# Altium schematic sheet WatchDog.SchDoc
size A; SheetNumber: 17; SheetTotal: 18
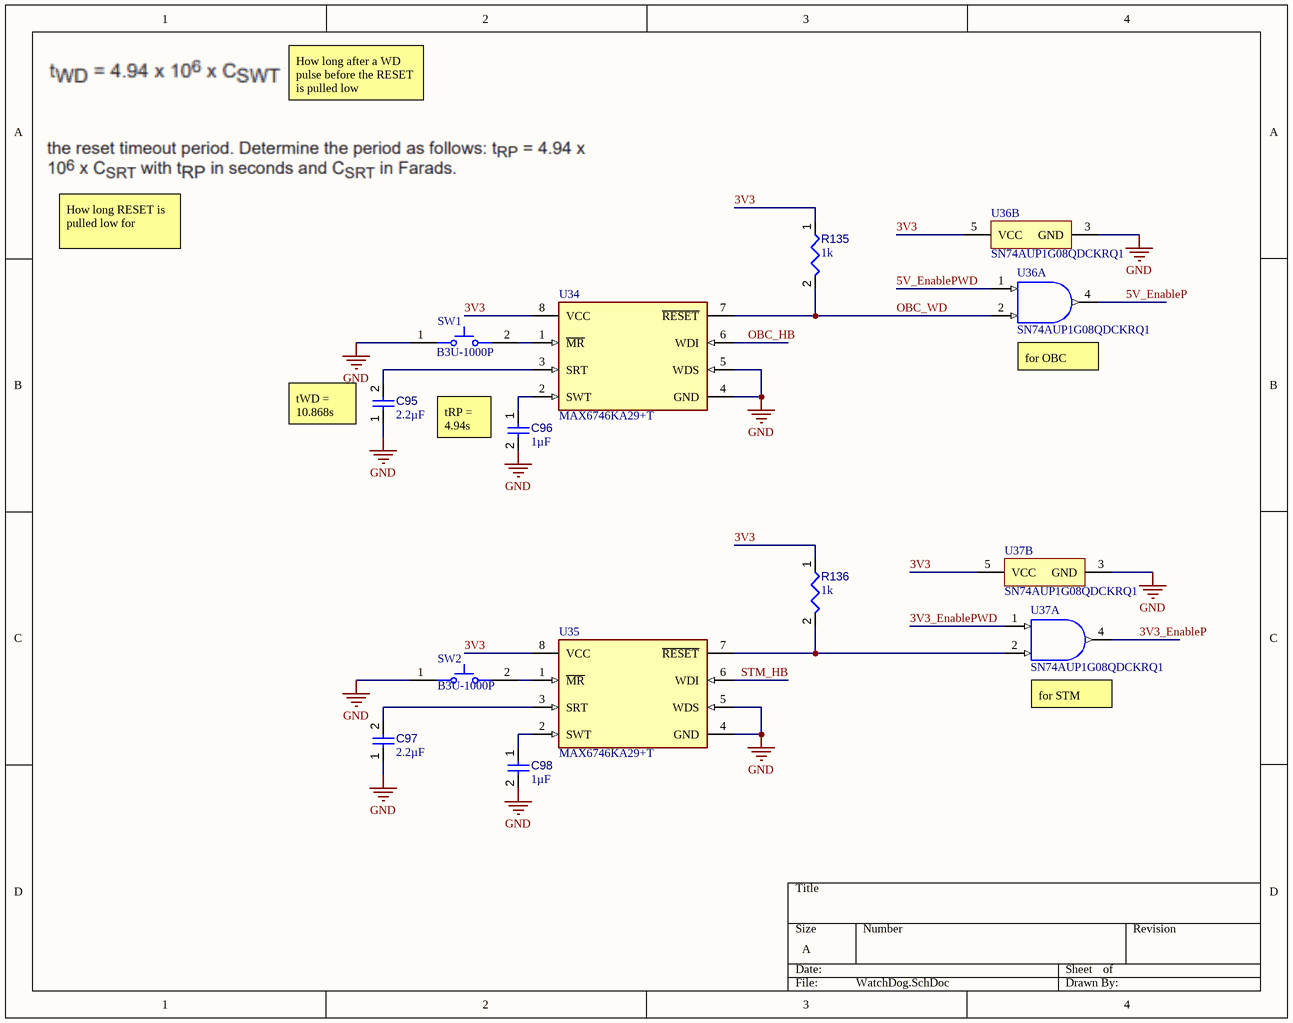
[diagram p0: WatchDog.SchDoc]

## Parts
C95  value 2.2µF  [CAPC0402(1005)60_L]  (hidden comment: Capacitor 2,2µF +/-20% 10V 0402)
C96  value 1µF  [CAPC0603(1608)100_L]  (hidden comment: Capacitor 1µF +/-40% 50V 0603)
C97  value 2.2µF  [CAPC0402(1005)60_L]  (hidden comment: Capacitor 2,2µF +/-20% 10V 0402)
C98  value 1µF  [CAPC0603(1608)100_L]  (hidden comment: Capacitor 1µF +/-40% 50V 0603)
R135  value 1k  [RESC0805(2012)_L]  (hidden comment: 1KR5J)
R136  value 1k  [RESC0805(2012)_L]  (hidden comment: 1KR5J)
SW1  B3U-1000P  [OMRON-B3U-1000_V]
SW2  B3U-1000P  [OMRON-B3U-1000_V]
U34  MAX6746KA29+T  [FP-K8-5-IPC_C]
U35  MAX6746KA29+T  [FP-K8-5-IPC_C]
U36  SN74AUP1G08QDCKRQ1  [DCK0005A_N]  (parts A,B of 2)
U37  SN74AUP1G08QDCKRQ1  [DCK0005A_N]  (parts A,B of 2)

## Nets
GND: C95.1 C96.2 C97.1 C98.2 SW1.1 SW2.1 U34.4(GND) U34.5(WDS) U35.4(GND) U35.5(WDS) U36.3(GND) U37.3(GND)
3V3: R135.1 R136.1 U34.8(VCC) U35.8(VCC) U36.5(VCC) U37.5(VCC)
3V3_EnableP: U37.4(Y)
3V3_EnablePWD: U37.1(A)
5V_EnableP: U36.4(Y)
5V_EnablePWD: U36.1(A)
OBC_HB: U34.6(WDI)
OBC_WD: R135.2 U34.7(~{RESET}) U36.2(B)
STM_HB: U35.6(WDI)
NetC95_2: C95.2 U34.3(SRT)
NetC96_1: C96.1 U34.2(SWT)
NetC97_2: C97.2 U35.3(SRT)
NetC98_1: C98.1 U35.2(SWT)
NetR136_2: R136.2 U35.7(~{RESET}) U37.2(B)
NetSW1_2: SW1.2 U34.1(~{MR})
NetSW2_2: SW2.2 U35.1(~{MR})

## Notes on the sheet
- How long after a WD pulse before the RESET is pulled low
- How long RESET is pulled low for
- (near U36) for OBC
- (near C95) tWD = 10.868s
- (near C96) tRP = 4.94s
- (near U37) for STM

## Library data of the parts
C95 C97 = CMP-001-00056-4: Chip Capacitor, 2,2µF +/-20%, 10V, 0402, Thickness 0.6 mm; Tolerance: 10%; Mounting Technology: SMT; Max Operating Temperature: 85°C; Case/Package: 0402; Pins: 2; Min Operating Temperature: -55°C; Voltage Rating: 10V
C96 C98 = CMP-001-00078-4: Chip Capacitor, 1µF +/-40%, 50V, 0603, Thickness 1 mm; Tolerance: 10%; Case/Package: 0603; Pins: 2; Max Operating Temperature: 85°C; Voltage Rating: 50V; Mounting Technology: SMT; Min Operating Temperature: -55°C
R135 R136 = CMP-009-00076-2: 1K 0.125W 5% 0805 (2012 Metric)  SMD; Power: 125mW; Pins: 2; Mounting Technology: SMT; Tolerance: 5%; Case/Package: 0805
SW1 SW2 = CMP-011-00000-2: Tactile Switch, SPST-NO, 0.05 A, 12 V, -25 to 70 degC, 2-Pin SMD, RoHS, Tape and Reel; Manufacturer: Omron Electronic Components; IP Rating: IP40; Current Rating: 50mA; Max Contact Resistance: 100mohm; Operating Force: 153gf; Throw Configuration: SPST; Resistance: 0.1Ohm; Max Voltage Rating (DC): 12V; Contact Material: Silver; Max Current Rating: 50mA; Datasheet URL: http://www.omron.com/ecb/products/pdf/en-b3u.pdf; Mounting Technology: SM; Case/Package: B3U-1000; Packaging: TapeandReel; Package Reference: B3U-1000; Manufacturer URL: http://www.omron.com/; Datasheet Version: Jan-15; RoHS Compliant: True; Max Operating Temperature: 70°C; Contact Current Rating: 50mA; Package Quantity: 3500; Package Description: 2-Pin Surface Mount Device, Body 3 x 2.5 mm; Voltage Rating (DC): 12V; Min Operating Temperature: -25°C; Voltage Rating: 12V
U34 U35 = CMP-00023-00003-1: Power Supply Management Circuit, Adjustable, 1 Channel, BICMOS, PDSO8; Pins: 8; RoHS Compliant: Yes; Max Operating Temperature: 125°C; Case/Package: LSSOP; Min Operating Temperature: -40°C
U36 U37 = CMP-016-00011-1: AND Gate, AUP/ULP/V Series, 1-Func, 2-Input, CMOS, PDSO5; Max Supply Voltage: 3.6V; Min Supply Voltage: 800mV; Nominal Supply Voltage: 3.3V; Case/Package: TSSOP; Max Operating Temperature: 125°C; RoHS Compliant: Yes; Pins: 5; Logic Type: AND GATE; Min Operating Temperature: -40°C